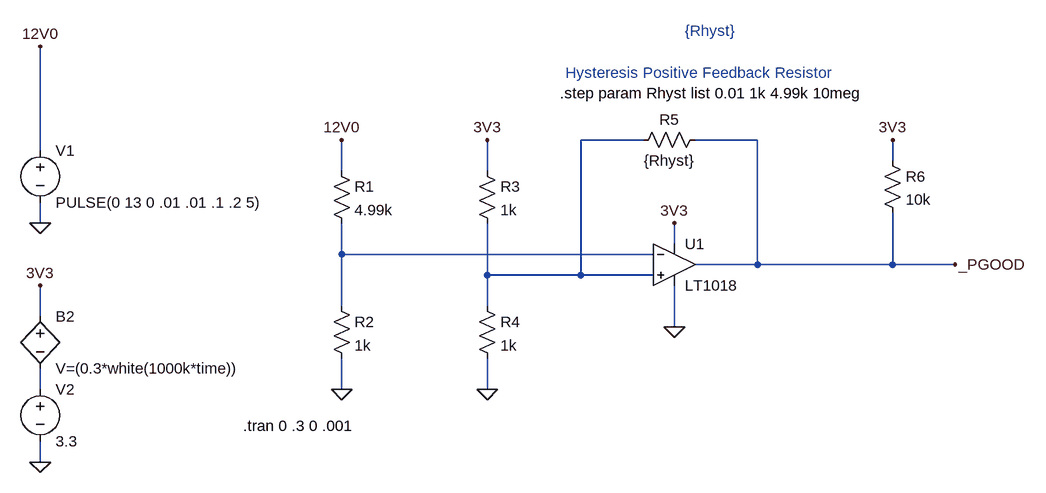
[diagram p0: schematic PGOOD Comparator Circuit.asc]
PGOOD Comparator Circuit.asc, the LTspice schematic file:
Version 4
SHEET 1 2472 804
WIRE 672 288 576 288
WIRE 848 288 752 288
WIRE -256 304 -256 144
WIRE 1056 320 1056 288
WIRE 208 336 208 288
WIRE 432 336 432 288
WIRE -256 416 -256 384
WIRE 720 448 720 416
WIRE 208 464 208 416
WIRE 688 464 208 464
WIRE 848 480 848 288
WIRE 848 480 752 480
WIRE 1056 480 1056 400
WIRE 1056 480 848 480
WIRE 1152 480 1056 480
WIRE 432 496 432 416
WIRE 576 496 576 288
WIRE 576 496 432 496
WIRE 688 496 576 496
WIRE 208 544 208 464
WIRE 432 544 432 496
WIRE -256 560 -256 512
WIRE 720 576 720 512
WIRE -256 672 -256 640
WIRE 208 672 208 624
WIRE 432 672 432 624
WIRE -256 784 -256 752
FLAG 720 576 0
FLAG 208 672 0
FLAG 432 672 0
FLAG -256 784 0
FLAG -256 416 0
FLAG -256 512 3V3
FLAG -256 144 12V0
FLAG 1152 480 _PGOOD
FLAG 432 288 3V3
FLAG 208 288 12V0
FLAG 720 416 3V3
FLAG 1056 288 3V3
SYMBOL voltage -256 288 R0
WINDOW 123 0 0 Left 0
WINDOW 39 0 0 Left 0
SYMATTR InstName V1
SYMATTR Value PULSE(0 13 0 .01 .01 .1 .2 5)
SYMBOL voltage -256 656 R0
WINDOW 123 0 0 Left 0
WINDOW 39 0 0 Left 0
SYMATTR InstName V2
SYMATTR Value 3.3
SYMBOL res 192 320 R0
SYMATTR InstName R1
SYMATTR Value 4.99k
SYMBOL res 192 528 R0
SYMATTR InstName R2
SYMATTR Value 1k
SYMBOL res 416 320 R0
SYMATTR InstName R3
SYMATTR Value 1k
SYMBOL res 416 528 R0
SYMATTR InstName R4
SYMATTR Value 1k
SYMBOL Comparators\\LT1018 720 480 R0
SYMATTR InstName U1
SYMBOL res 768 272 R90
WINDOW 0 0 56 VBottom 2
WINDOW 3 32 56 VTop 2
SYMATTR InstName R5
SYMATTR Value {Rhyst}
SYMBOL bv -256 544 R0
SYMATTR InstName B2
SYMATTR Value V=(0.3*white(1000k*time))
SYMBOL res 1040 304 R0
SYMATTR InstName R6
SYMATTR Value 10k
TEXT 56 728 Left 2 !.tran 0 .3 0 .001
TEXT 552 184 Left 2 ;Hysteresis Positive Feedback Resistor
TEXT 544 216 Left 2 !.step param Rhyst list 0.01 1k 4.99k 10meg
TEXT 736 120 Left 2 ;{Rhyst}

The netlist it stands for:
* PGOOD Comparator Circuit.asc
V1 12V0 0 PULSE(0 13 0 .01 .01 .1 .2 5)
V2 N003 0 3.3
R1 12V0 N002 4.99k
R2 N002 0 1k
R3 3V3 N001 1k
R4 N001 0 1k
XU1 N001 N002 3V3 0 _PGOOD LT1018  ; pins In+ In- V+ V- OUT
R5 _PGOOD N001 {Rhyst}
B2 3V3 N003 V=(0.3*white(1000k*time))
R6 3V3 _PGOOD 10k
.tran 0 .3 0 .001
* Hysteresis Positive Feedback Resistor
.step param Rhyst list 0.01 1k 4.99k 10meg
* {Rhyst}
.lib LTC1.lib
.backanno
.end